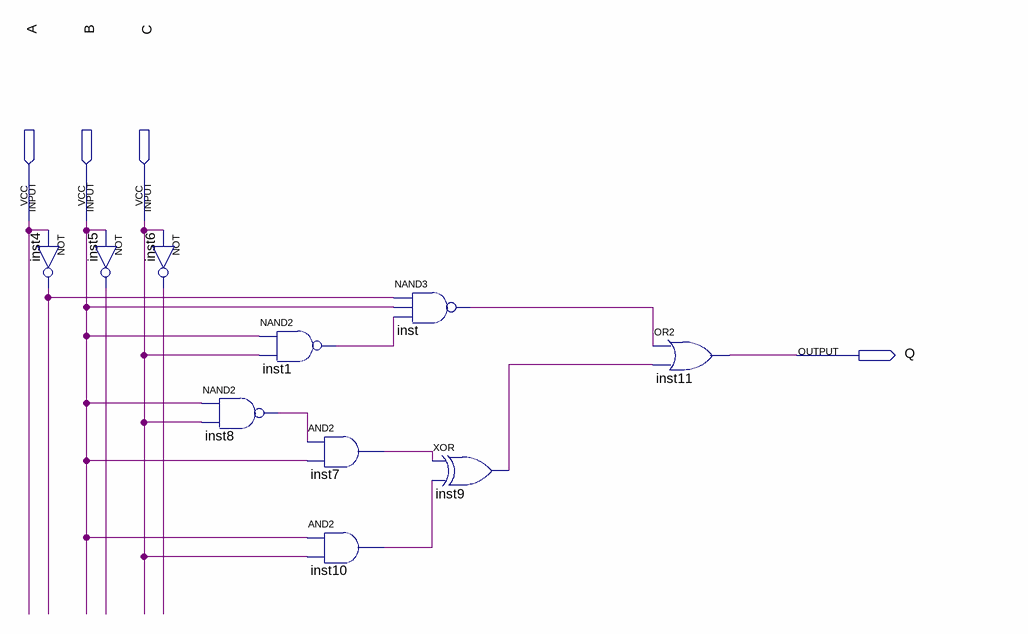
[diagram p0: schematic sheet]
// Quartus schematic test_one.bdf as structural Verilog: 10 symbols, 4 pins
module test_one (
  input  A,
  input  B,
  input  C,
  output Q
);

  wire inst1_out, inst4_out, inst5_out, inst6_out, inst7_out, inst8_out, inst9_out, inst10_out, inst_out;

  not inst4 (inst4_out, A);
  not inst5 (inst5_out, B);
  not inst6 (inst6_out, C);
  nand inst8 (inst8_out, B, C);
  nand inst1 (inst1_out, B, C);
  and inst7 (inst7_out, inst8_out, B);
  and inst10 (inst10_out, B, C);
  nand inst (inst_out, inst4_out, B, inst1_out);
  xor inst9 (inst9_out, inst7_out, inst10_out);
  or inst11 (Q, inst_out, inst9_out);
endmodule
